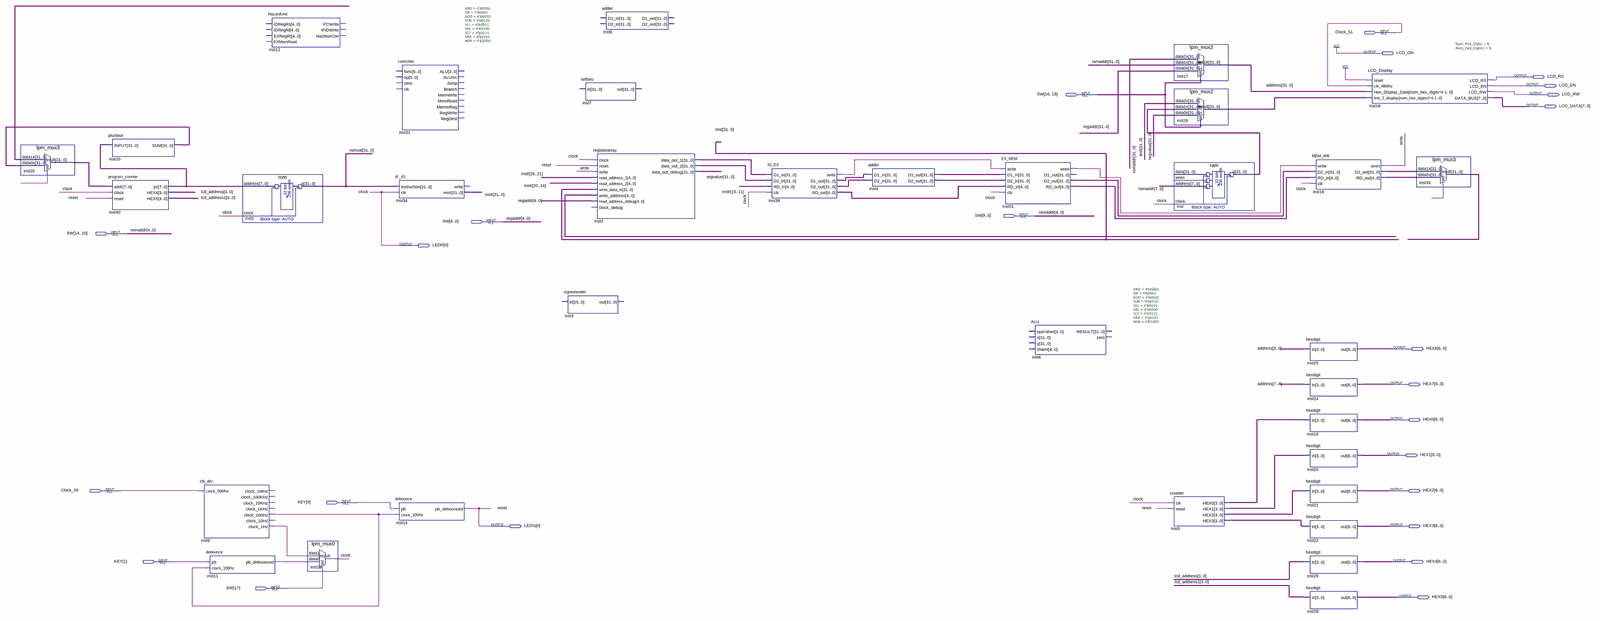
[diagram p0: schematic sheet, whole]
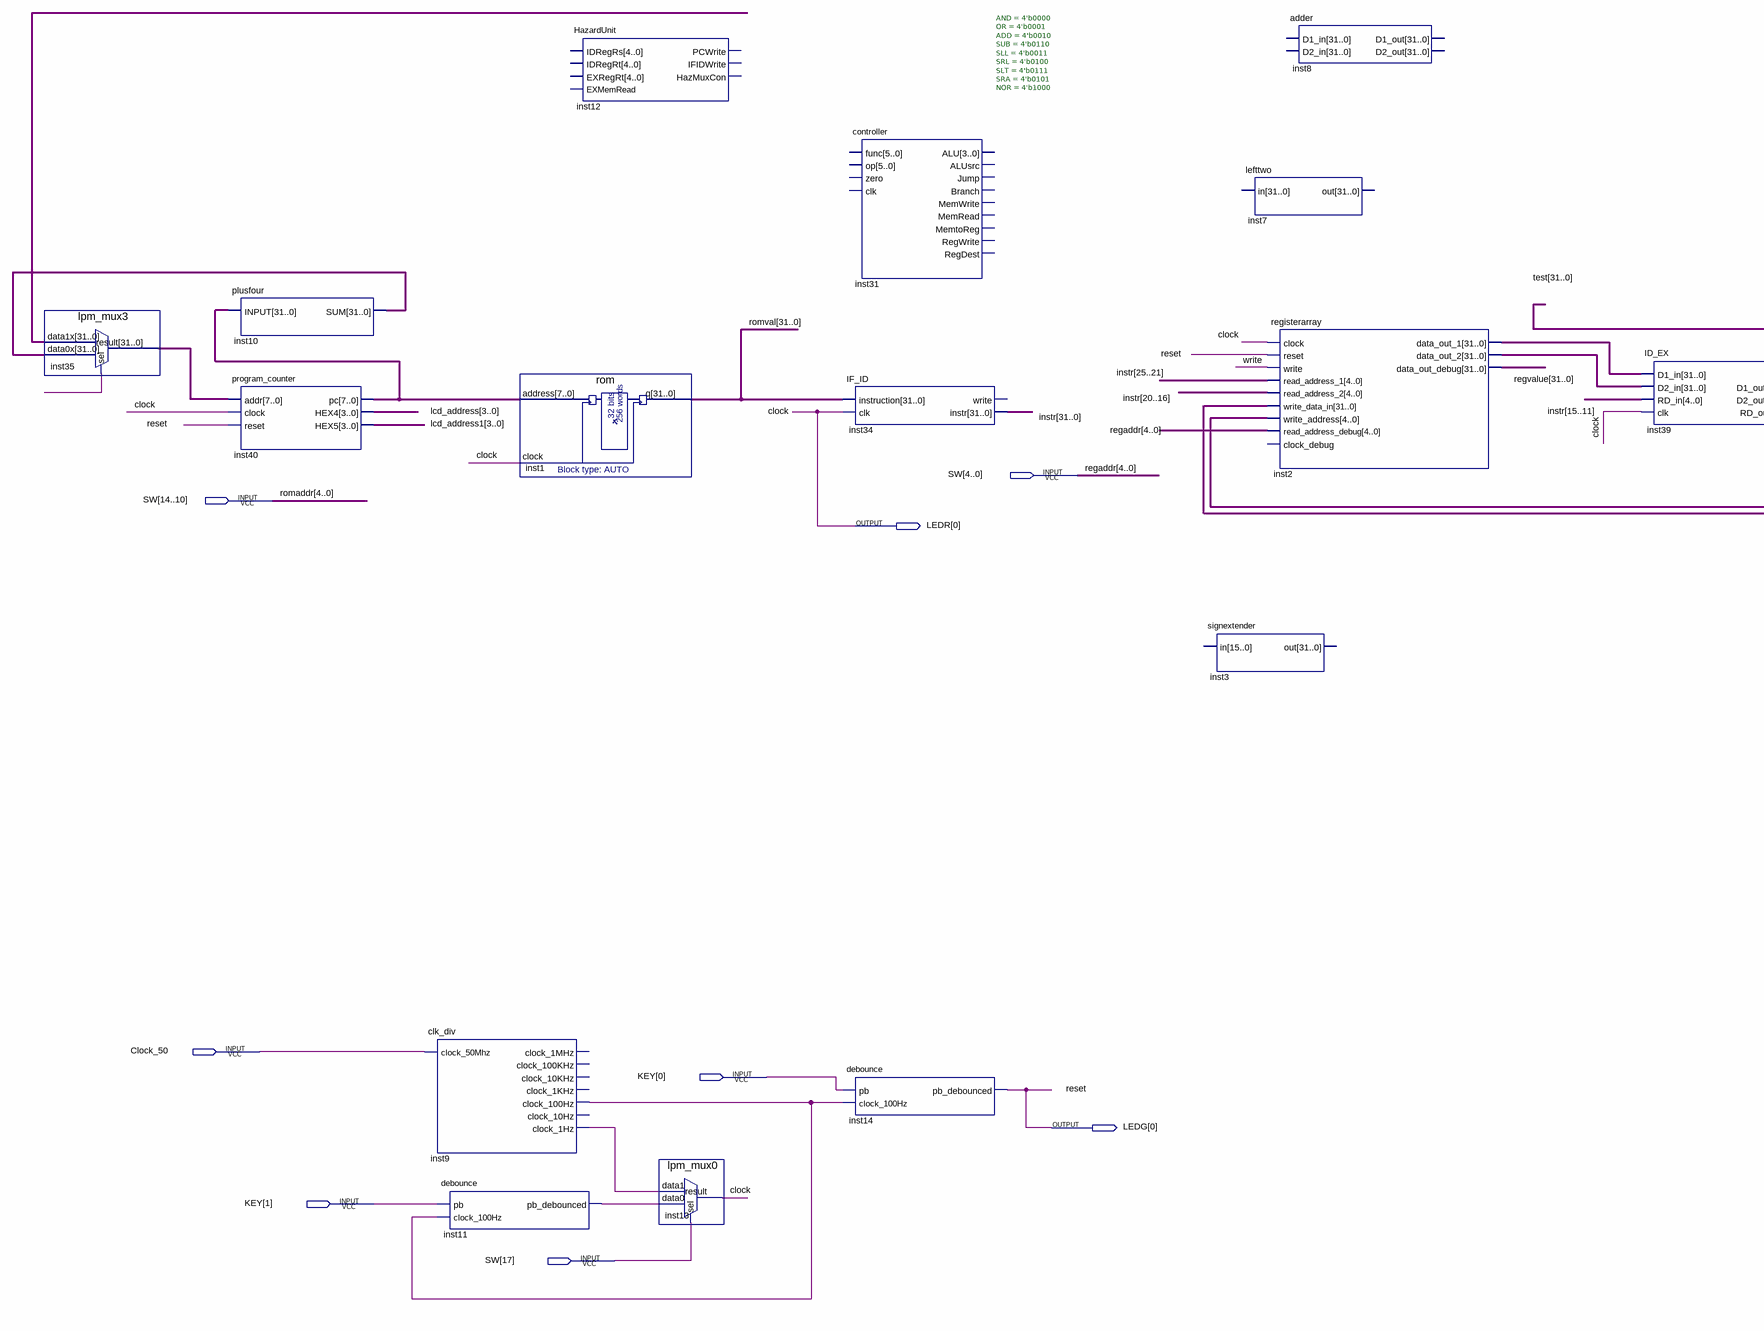
[diagram p1: schematic sheet, left part]
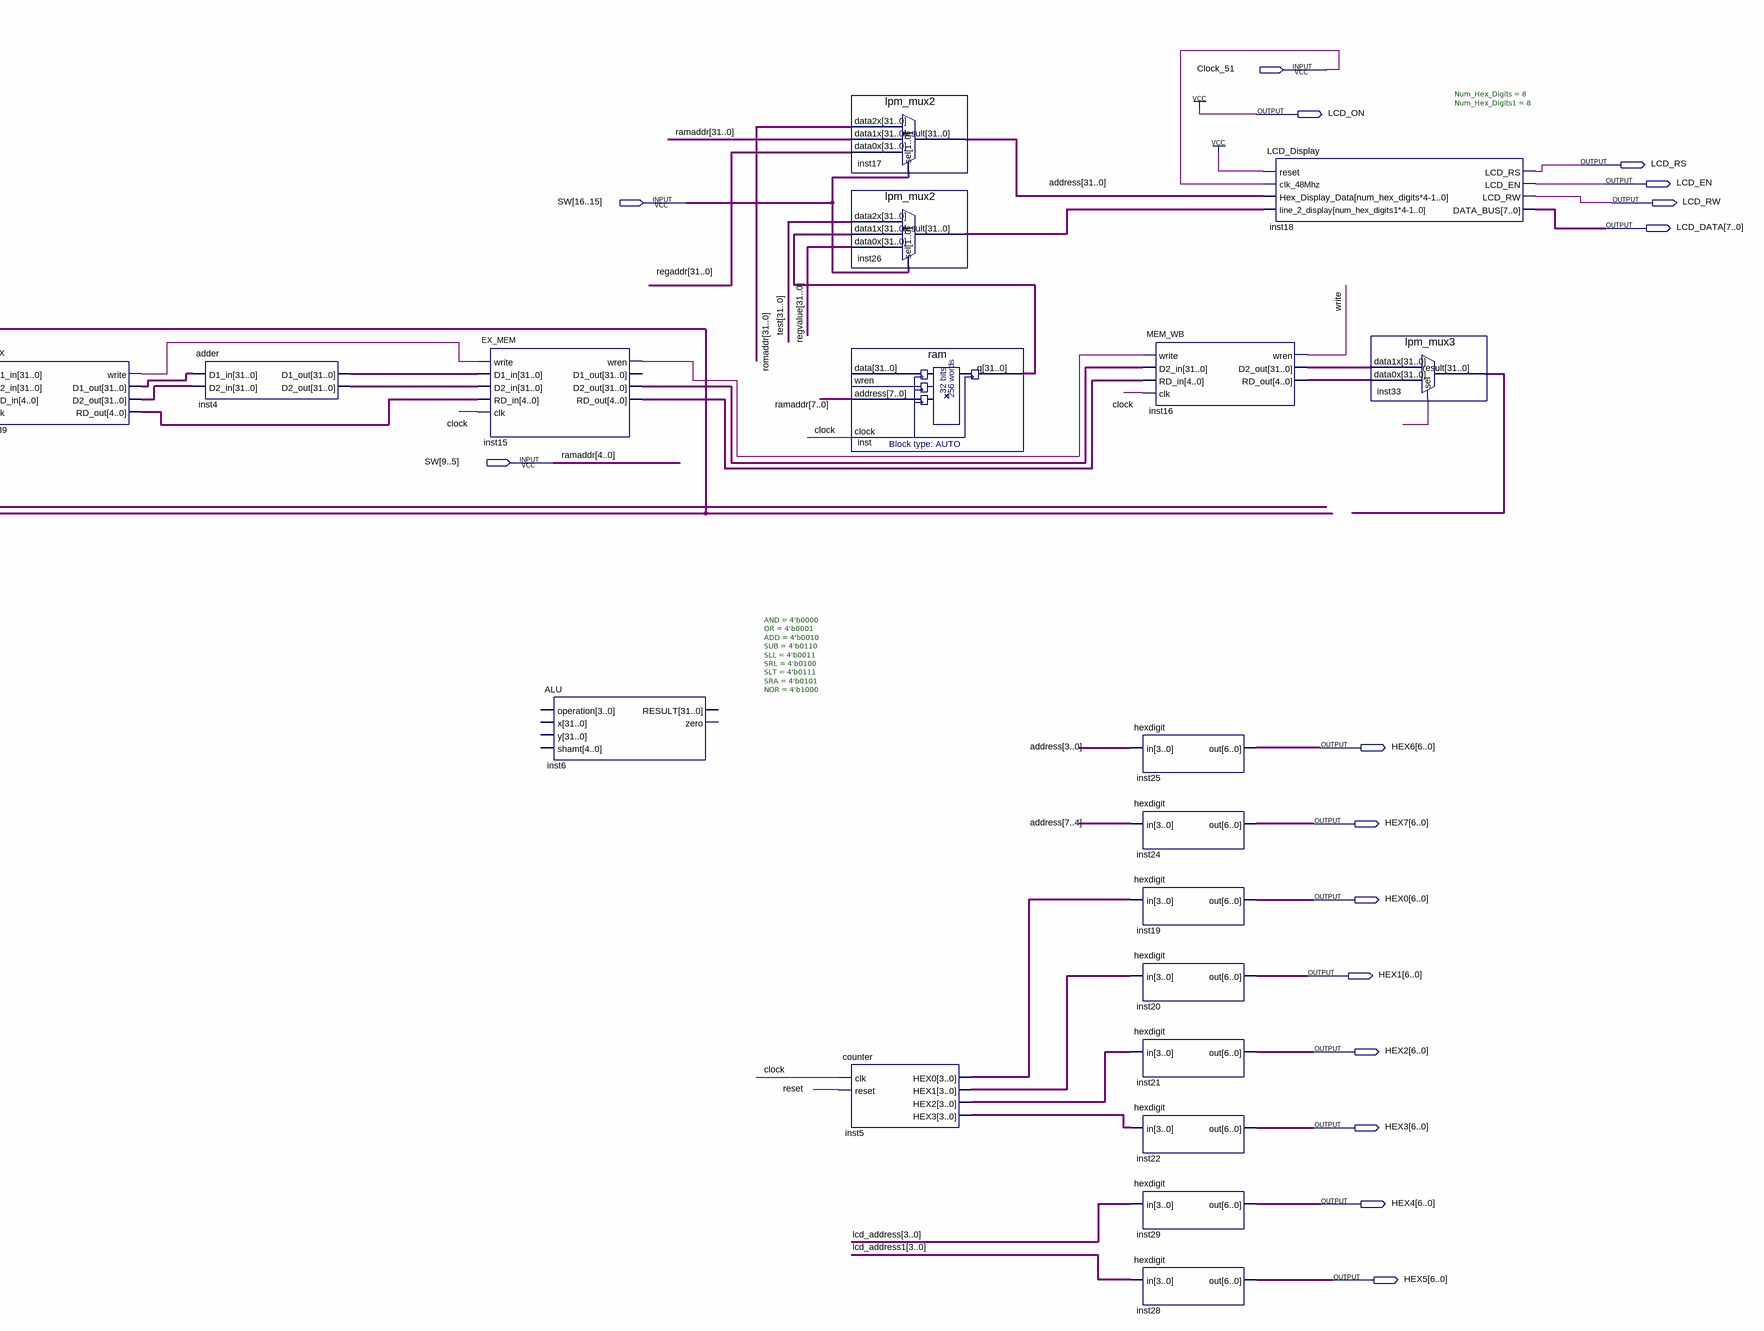
[diagram p2: schematic sheet, right part]
// Quartus schematic LPM.bdf as structural Verilog: 34 symbols, 24 pins
module LPM (
  input  Clock_51,
  input  [17:0] SW,
  input  Clock_50,
  input  [1:0] KEY,
  output LCD_ON,
  output LCD_RS,
  output LCD_EN,
  output LCD_RW,
  output [7:0] LCD_DATA,
  output [0:0] LEDR,
  output [6:0] HEX6,
  output [6:0] HEX7,
  output [6:0] HEX0,
  output [6:0] HEX1,
  output [6:0] HEX2,
  output [0:0] LEDG,
  output [6:0] HEX3,
  output [6:0] HEX4,
  output [6:0] HEX5
);

  wire inst9_clock_1hz, inst9_clock_100hz, inst11_pb_debounced, inst15_wren, inst39_write, undriven_2,
       undriven_4, write;
  wire [3:0] inst5_hex0, inst5_hex1, inst5_hex2, inst5_hex3, lcd_address, lcd_address1;
  wire [4:0] inst15_rd_out, inst39_rd_out, undriven;
  wire [31:0] address, inst2_data_out_1, inst2_data_out_2, inst4_d1_out, inst4_d2_out, inst10_sum,
       inst15_d2_out, inst16_d2_out, inst16_rd_out, inst26_result, inst33_result, inst35_result,
       inst39_d1_out, inst39_d2_out, inst40_pc, inst_q, instr, regvalue, romval, test, undriven_3;
  wire [31:5] ramaddr, regaddr, romaddr;

  lpm_mux3 inst35 (.data1x(undriven_3), .data0x(inst10_sum), .sel(undriven_4), .result(inst35_result));
  plusfour inst10 (.INPUT(inst40_pc), .SUM(inst10_sum));
  program_counter inst40 (
    .addr(inst35_result), .clock(LEDR[0]), .reset(LEDG[0]), .pc(inst40_pc), .HEX4(lcd_address),
    .HEX5(lcd_address1));
  clk_div inst9 (
    .clock_50Mhz(Clock_50), .clock_100Hz(inst9_clock_100hz), .clock_1Hz(inst9_clock_1hz));  // open: clock_1MHz, clock_100KHz, clock_10KHz, clock_1KHz, clock_10Hz
  debounce inst11 (.pb(KEY[1]), .clock_100Hz(inst9_clock_100hz), .pb_debounced(inst11_pb_debounced));
  rom inst1 (.address(inst40_pc), .clock(LEDR[0]), .q(romval));
  HazardUnit inst12 ();  // open: IDRegRs, IDRegRt, EXRegRt, EXMemRead, PCWrite, IFIDWrite, HazMuxCon
  lpm_mux0 inst13 (.data1(inst9_clock_1hz), .data0(inst11_pb_debounced), .sel(SW[17]), .result(LEDR[0]));
  controller #(.AND(4'b0000), .OR(4'b0001), .ADD(4'b0010), .SUB(4'b0110), .SLL(4'b0011), .SRL(4'b0100), .SLT(4'b0111), .SRA(4'b0101), .NOR(4'b1000)) inst31 ();  // open: func, op, zero, clk, ALU, ALUsrc, Jump, Branch, MemWrite, MemRead, MemtoReg, RegWrite, RegDest
  IF_ID inst34 (.instruction(romval), .clk(LEDR[0]), .instr(instr));  // open: write
  debounce inst14 (.pb(KEY[0]), .clock_100Hz(inst9_clock_100hz), .pb_debounced(LEDG[0]));
  signextender inst3 ();  // open: in, out
  lefttwo inst7 ();  // open: in, out
  registerarray inst2 (
    .clock(LEDR[0]), .reset(LEDG[0]), .write(write), .read_address_1(instr[25:21]),
    .read_address_2(instr[20:16]), .write_data_in(test), .write_address(undriven),
    .read_address_debug(SW[4:0]), .data_out_1(inst2_data_out_1), .data_out_2(inst2_data_out_2),
    .data_out_debug(regvalue));  // open: clock_debug
  adder inst8 ();  // open: D1_in, D2_in, D1_out, D2_out
  ID_EX inst39 (
    .D1_in(inst2_data_out_1), .D2_in(inst2_data_out_2), .RD_in(instr[15:11]), .clk(LEDR[0]),
    .write(inst39_write), .D1_out(inst39_d1_out), .D2_out(inst39_d2_out), .RD_out(inst39_rd_out));
  adder inst4 (.D1_in(inst39_d1_out), .D2_in(inst39_d2_out), .D1_out(inst4_d1_out), .D2_out(inst4_d2_out));
  EX_MEM inst15 (
    .write(inst39_write), .D1_in(inst4_d1_out), .D2_in(inst4_d2_out), .RD_in(inst39_rd_out), .clk(LEDR[0]),
    .wren(inst15_wren), .D2_out(inst15_d2_out), .RD_out(inst15_rd_out));  // open: D1_out
  ALU #(.AND(4'b0000), .OR(4'b0001), .ADD(4'b0010), .SUB(4'b0110), .SLL(4'b0011), .SRL(4'b0100), .SLT(4'b0111), .SRA(4'b0101), .NOR(4'b1000)) inst6 ();  // open: operation, x, y, shamt, RESULT, zero
  lpm_mux2 inst17 (
    .data2x({romaddr, SW[14:10]}), .data1x({ramaddr, SW[9:5]}), .data0x({regaddr, SW[4:0]}), .sel(SW[16:15]),
    .result(address));
  lpm_mux2 inst26 (.data2x(test), .data1x(inst_q), .data0x(regvalue), .sel(SW[16:15]), .result(inst26_result));
  ram inst (.address({ramaddr[7:5], SW[9:5]}), .clock(LEDR[0]), .q(inst_q));  // open: data, wren
  counter inst5 (
    .clk(LEDR[0]), .reset(LEDG[0]), .HEX0(inst5_hex0), .HEX1(inst5_hex1), .HEX2(inst5_hex2), .HEX3(inst5_hex3));
  hexdigit inst25 (.in(address[3:0]), .out(HEX6));
  hexdigit inst24 (.in(address[7:4]), .out(HEX7));
  hexdigit inst19 (.in(inst5_hex0), .out(HEX0));
  hexdigit inst20 (.in(inst5_hex1), .out(HEX1));
  hexdigit inst21 (.in(inst5_hex2), .out(HEX2));
  hexdigit inst22 (.in(inst5_hex3), .out(HEX3));
  hexdigit inst29 (.in(lcd_address), .out(HEX4));
  hexdigit inst28 (.in(lcd_address1), .out(HEX5));
  MEM_WB inst16 (
    .write(inst15_wren), .D2_in(inst15_d2_out), .RD_in(inst15_rd_out), .clk(LEDR[0]), .wren(write),
    .D2_out(inst16_d2_out), .RD_out(inst16_rd_out));
  LCD_Display #(.Num_Hex_Digits(8), .Num_Hex_Digits1(8)) inst18 (
    .reset(1'b1), .clk_48Mhz(Clock_51), .Hex_Display_Data(address), .line_2_display(inst26_result),
    .LCD_RS(LCD_RS), .LCD_EN(LCD_EN), .LCD_RW(LCD_RW), .DATA_BUS(LCD_DATA));
  lpm_mux3 inst33 (.data1x(inst16_d2_out), .data0x(inst16_rd_out), .sel(undriven_2), .result(inst33_result));

  assign LCD_ON = 1'b1;

  // Other names for the same wires on the sheet: clock = LEDR[0]; reset = LEDG[0]; ramaddr[4:0] = SW[9:5];
  //   regaddr[4:0] = SW[4:0]; romaddr[4:0] = SW[14:10]
endmodule
